# Altium schematic sheet Communication.SchDoc: Access Control
size A; DrawnBy: Q.Thang & T.Khoa; Revision: V1.0.1; SheetNumber: 8; SheetTotal: 16
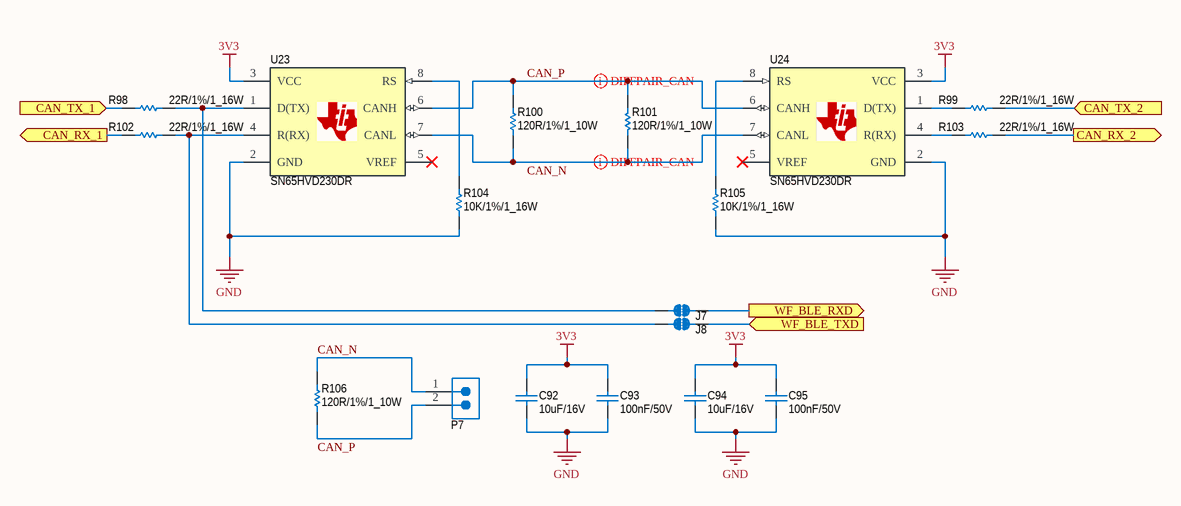
[diagram p0: Communication.SchDoc]

## Parts
C92  10uF/16V  [CAP_0603]
C93  100nF/50V  [CAP_0603]
C94  10uF/16V  [CAP_0603]
C95  100nF/50V  [CAP_0603]
J7  Jumper_Open  [SolderBridgeOpen]  (value not drawn)
J8  Jumper_Open  [SolderBridgeOpen]  (value not drawn)
P7  3.81mm_2P  [Terminal_Block_3.81mm_2P]  (value not drawn)
R98  22R/1%/1_16W  [RESISTOR_0402]
R99  22R/1%/1_16W  [RESISTOR_0402]
R100  120R/1%/1_10W  [Resistor_0603]
R101  120R/1%/1_10W  [Resistor_0603]
R102  22R/1%/1_16W  [RESISTOR_0402]
R103  22R/1%/1_16W  [RESISTOR_0402]
R104  10K/1%/1_16W  [RESISTOR_0402]
R105  10K/1%/1_16W  [RESISTOR_0402]
R106  120R/1%/1_10W  [Resistor_0603]
U23  SN65HVD230DR  [SOIC-8]
U24  SN65HVD230DR  [SOIC-8]

## Ports
CAN_RX_1 (out, see Overview_Schematic[4B]), CAN_RX_2 (out, see Overview_Schematic[5B]), CAN_TX_1 (in, see Overview_Schematic[4B]), CAN_TX_2 (in, see Overview_Schematic[5B]), WF_BLE_RXD (out, see Overview_Schematic[5B], ESP32_WiFi[4B]), WF_BLE_TXD (in, see Overview_Schematic[5B], ESP32_WiFi[4B])

## Nets
3V3: C92.2 C93.2 C94.2 C95.2 U23.3(VCC) U24.3(VCC)
GND: C92.1 C93.1 C94.1 C95.1 R104.2 R105.2 U23.2(GND) U24.2(GND)
CAN_N: P7.1 R100.1 R101.2 R106.2 U23.7(CANL) U24.7(CANL)
CAN_P: P7.2 R100.2 R101.1 R106.1 U23.6(CANH) U24.6(CANH)
CAN_RX_1: R102.1 ; port CAN_RX_1
CAN_RX_2: R103.2 ; port CAN_RX_2
CAN_TX_1: R98.1 ; port CAN_TX_1
CAN_TX_2: R99.2 ; port CAN_TX_2
WF_BLE_RXD: J7.2 ; port WF_BLE_RXD
WF_BLE_TXD: J8.2 ; port WF_BLE_TXD
NetJ7_1: J7.1 R98.2 U23.1(D(TX))
NetJ8_1: J8.1 R102.2 U23.4(R(RX))
NetR99_1: R99.1 U24.1(D(TX))
NetR103_1: R103.1 U24.4(R(RX))
NetR104_1: R104.1 U23.8(RS)
NetR105_1: R105.1 U24.8(RS)

Not connected (* = marked no-connect by the designer): U23 5(VREF)*; U24 5(VREF)*

## Layout directives
differential pair: CAN_N, CAN_P

## Notes on the sheet
- Project Name
- Size
- A4
- Revision
- Checked By:
- Drawn By:
- Date:
- File:
- Last Modified:
- Sheet
- of

## Library data of the parts
C92 C94 = Ceramic_Cap_10uF_16V_0603: CAP, size 0603, 10uF, 16V; Supply Part Number: Tụ Gốm 0603 10uF 16V; Supply Name: Thegioiic; Datasheet: *; Supply URL: https://www.thegioiic.com/tu-gom-0603-10uf-16v
C93 C95 = Ceramic_Cap_100nF_50V_0603: CAP, size 0603, 100nF, 50V; Supply Part Number: Tụ Gốm 0603 100nF (0.1uF) 50V; Supply Name: Thegioiic; Datasheet: *; Supply URL: https://www.thegioiic.com/tu-gom-0603-100nf-0-1uf-50v
P7 = Terminal_Block_3.81mm_2P: Terminal Block THT, pitch 3.81mm, 2p, 300V, 10A; Supply Part Number: UL-3.81-2-R Terminal Block Plug-in Hàn PCB 2 Chân Cong 3.81mm 300V 10A ULO; Supply Name: Thegioiic; Supply URL: https://www.thegioiic.com/ul-3-81-2-r-terminal-block-plug-in-han-pcb-2-chan-cong-3-81mm-300v-10a-ulo
R98 R99 R102 R103 = Res_22R_0402_1%: Resistor 0402 22 Ohm 1% 1_16W; Supply Name: *; Supply Part Number: *; Supply URL: *
R100 R101 R106 = Res_120R_0603_1%: Resistor 0603 120 Ohm 1% 1_10W; Supply Part Number: Điện Trở 120 Ohm 0603 1%; Supply Name: Thegioiic; Supply URL: https://www.thegioiic.com/dien-tro-120-ohm-0603-1-
R104 R105 = Res_10K_0402_1%: Resistor 0402 10KOhm 1% 1_16W; Supply Part Number: Điện Trở 10 KOhm 0402 1%; Supply Name: Thegioiic; Supply URL: https://www.thegioiic.com/dien-tro-10-kohm-0402-1-
U23 U24 = SN65HVD230DR: 1/1 Transceiver Half CANbus; Supply Part Number: SN65HVD230DR CAN Transceiver 8-SOIC; Supply Name: Thegioiic; Datasheet: https://www.ti.com/lit/ds/symlink/sn65hvd230.pdf; Supply URL: https://www.thegioiic.com/sn65hvd230dr-can-transceiver-8-soic
J7 J8 = Jumper_Open: Datasheet: *; Supply Name: *; Supply Part Number: *; Supply URL: *